# Altium schematic sheet HDMI.SchDoc: Dahlia Carrier Board
size A3; Organization: Toradex AG; Address1: Ebenaustrasse 10; Address2: Horw; Address3: 6048; Address4: Switzerland; DocumentNumber: 9; Revision: V1.1; SheetNumber: 9; SheetTotal: 21; PageSetup: Record=PageOptions|CenterHorizontal=True|CenterVertical=True|PrintScale=0.71|XCorrection=1.00|YCorrection=1.00|PrintKind=1|BorderSize=5000000|LeftOffset=0|BottomOffset=0|Orientation=2|PaperLength=1000|PaperWidth=1000|Scale=100|PaperSource=15|PrintQuality=600|MediaType=1|DitherType=10|PaperKind=A4|PrintScaleMode=1
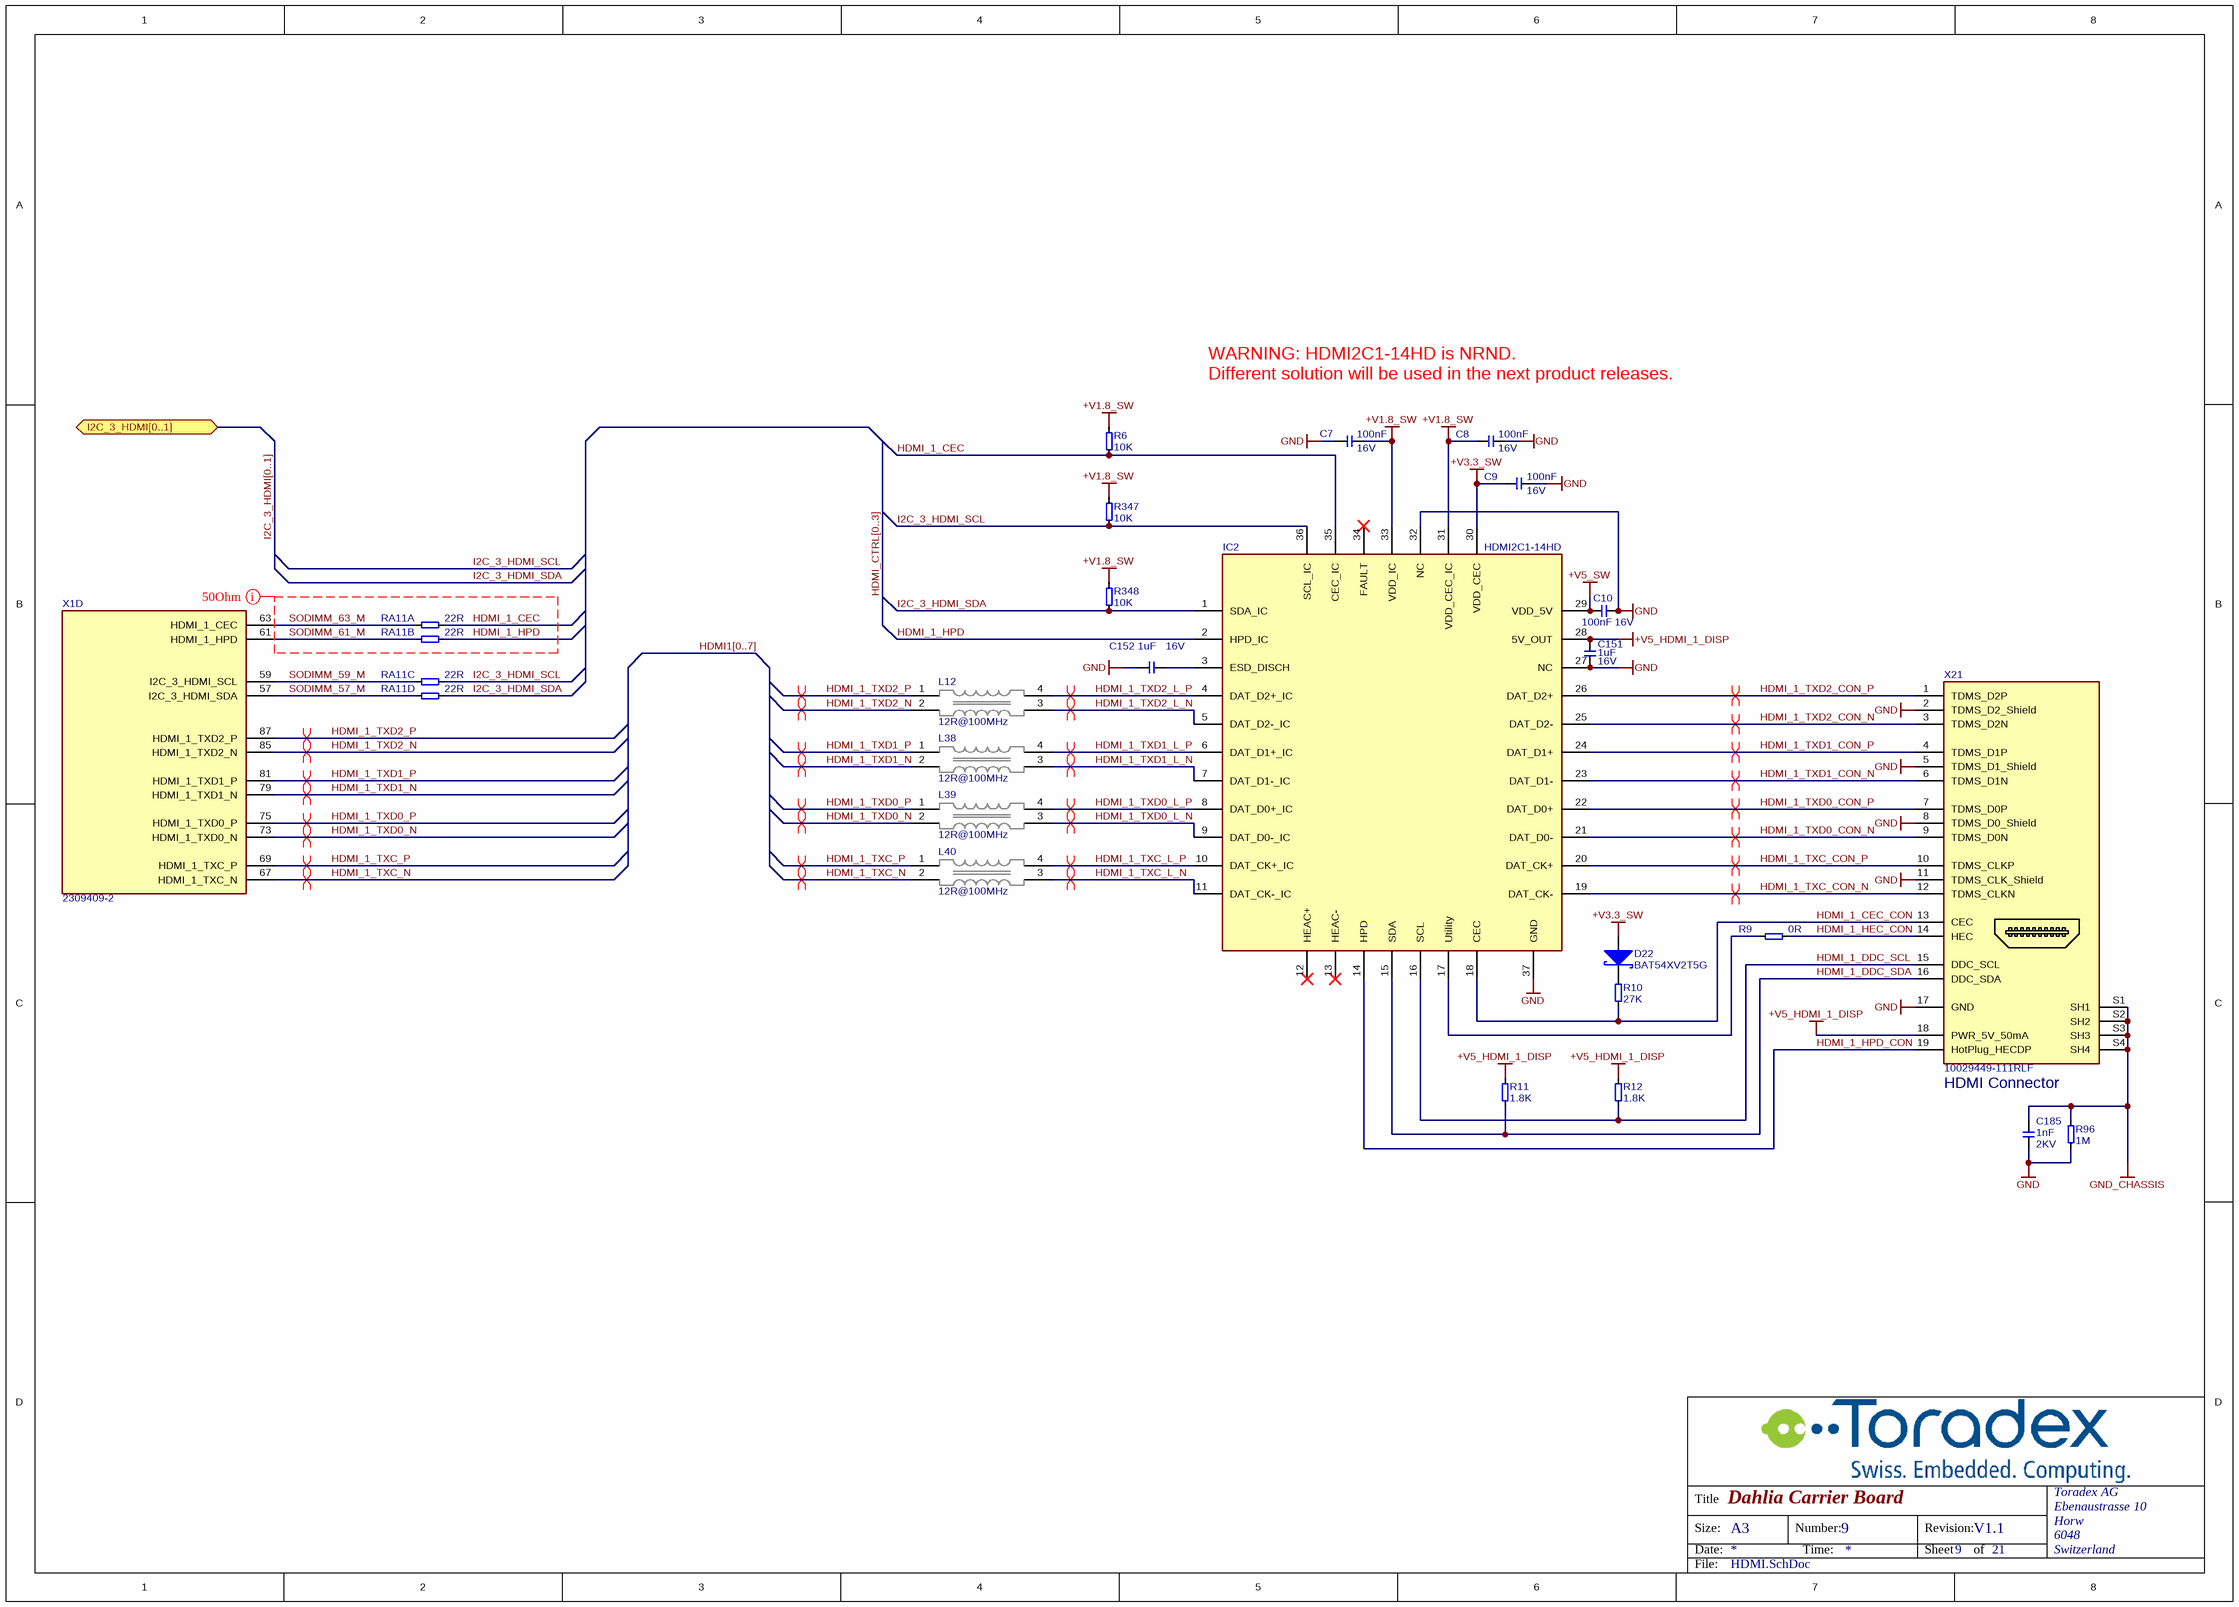
[diagram p0: HDMI.SchDoc]

## Parts
C7  Rating: 16V  [CAPC1005X60N]  (hidden comment: 100nF)
C8  Rating: 16V  [CAPC1005X60N]  (hidden comment: 100nF)
C9  Rating: 16V  [CAPC1005X60N]  (hidden comment: 100nF)
C10  Rating: 16V  [CAPC1005X60N]  (hidden comment: 100nF)
C151  Rating: 16V  [CAPC1005X60N]  (hidden comment: 1uF)
C152  Rating: 16V  [CAPC1005X60N]  (hidden comment: 1uF)
C185  Rating: 2KV  [T_CAPC1206X180N]  (hidden comment: 1nF)
D22  BAT54XV2T5G  [SOD-523]
IC2  HDMI2C1-14HD  [QFN50P350X650X95_HS-37N]
L12  12R@100MHz  [T_Panasonic_EXC14CH120U]
L38  12R@100MHz  [T_Panasonic_EXC14CH120U]
L39  12R@100MHz  [T_Panasonic_EXC14CH120U]
L40  12R@100MHz  [T_Panasonic_EXC14CH120U]
R6  10K  [RESC1005X40N]
R9  0R  [T_RESC0603X30N]
R10  27K  [RESC1005X40N]
R11  1.8K  [RESC1005X40N]
R12  1.8K  [RESC1005X40N]
R96  1M  [RESC3216X75N]
R347  10K  [RESC1005X40N]
R348  10K  [RESC1005X40N]
RA11  22R  [T_Resistor_Array_X4]  (parts A,B,C,D of 4)
X1  2309409-2  [CON-TE-2309409-2-SOLDERABLE-STANDOFFS]  (part D of 23)
X21  10029449-111RLF  [T_FCI_10029449-111RLF]

## Ports
I2C_3_HDMI[0..1] (bidir)

## Nets
+V1.8_SW: C7.2 C8.1 IC2.31(VDD_CEC_IC) IC2.33(VDD_IC) R6.2 R347.1 R348.1
+V3.3_SW: C9.2 D22.A IC2.30(VDD_CEC)
+V5_HDMI_1_DISP: C151.2 IC2.28(5V_OUT) R11.2 R12.2 X21.18(PWR_5V_50mA)
+V5_SW: C10.2 IC2.29(VDD_5V)
GND: C7.1 C8.2 C9.1 C10.1 C151.1 C152.2 C185.1 IC2.27(NC) IC2.32(NC) IC2.37(GND) R96.1 X21.2(TDMS_D2_Shield) X21.5(TDMS_D1_Shield) X21.8(TDMS_D0_Shield) X21.11(TDMS_CLK_Shield) X21.17(GND)
GND_CHASSIS: C185.2 R96.2 X21.S1(SH1) X21.S2(SH2) X21.S3(SH3) X21.S4(SH4)
HDMI_1_CEC: IC2.35(CEC_IC) R6.1 RA11.5
HDMI_1_CEC_CON: IC2.18(CEC) R10.1 X21.13(CEC)
HDMI_1_DDC_SCL: IC2.16(SCL) R12.1 X21.15(DDC_SCL)
HDMI_1_DDC_SDA: IC2.15(SDA) R11.1 X21.16(DDC_SDA)
HDMI_1_HEC_CON: R9.2 X21.14(HEC)
HDMI_1_HPD: IC2.2(HPD_IC) RA11.6
HDMI_1_HPD_CON: IC2.14(HPD) X21.19(HotPlug_HECDP)
HDMI_1_TXC_CON_N: IC2.19(DAT_CK-) X21.12(TDMS_CLKN)
HDMI_1_TXC_CON_P: IC2.20(DAT_CK+) X21.10(TDMS_CLKP)
HDMI_1_TXC_L_N: IC2.11(DAT_CK-_IC) L40.3
HDMI_1_TXC_L_P: IC2.10(DAT_CK+_IC) L40.4
HDMI_1_TXC_N: L40.2 X1.67(HDMI_1_TXC_N)
HDMI_1_TXC_P: L40.1 X1.69(HDMI_1_TXC_P)
HDMI_1_TXD0_CON_N: IC2.21(DAT_D0-) X21.9(TDMS_D0N)
HDMI_1_TXD0_CON_P: IC2.22(DAT_D0+) X21.7(TDMS_D0P)
HDMI_1_TXD0_L_N: IC2.9(DAT_D0-_IC) L39.3
HDMI_1_TXD0_L_P: IC2.8(DAT_D0+_IC) L39.4
HDMI_1_TXD0_N: L39.2 X1.73(HDMI_1_TXD0_N)
HDMI_1_TXD0_P: L39.1 X1.75(HDMI_1_TXD0_P)
HDMI_1_TXD1_CON_N: IC2.23(DAT_D1-) X21.6(TDMS_D1N)
HDMI_1_TXD1_CON_P: IC2.24(DAT_D1+) X21.4(TDMS_D1P)
HDMI_1_TXD1_L_N: IC2.7(DAT_D1-_IC) L38.3
HDMI_1_TXD1_L_P: IC2.6(DAT_D1+_IC) L38.4
HDMI_1_TXD1_N: L38.2 X1.79(HDMI_1_TXD1_N)
HDMI_1_TXD1_P: L38.1 X1.81(HDMI_1_TXD1_P)
HDMI_1_TXD2_CON_N: IC2.25(DAT_D2-) X21.3(TDMS_D2N)
HDMI_1_TXD2_CON_P: IC2.26(DAT_D2+) X21.1(TDMS_D2P)
HDMI_1_TXD2_L_N: IC2.5(DAT_D2-_IC) L12.3
HDMI_1_TXD2_L_P: IC2.4(DAT_D2+_IC) L12.4
HDMI_1_TXD2_N: L12.2 X1.85(HDMI_1_TXD2_N)
HDMI_1_TXD2_P: L12.1 X1.87(HDMI_1_TXD2_P)
I2C_3_HDMI_SCL: IC2.36(SCL_IC) R347.2 RA11.7
I2C_3_HDMI_SDA: IC2.1(SDA_IC) R348.2 RA11.8
SODIMM_57_M: RA11.4 X1.57(I2C_3_HDMI_SDA)
SODIMM_59_M: RA11.3 X1.59(I2C_3_HDMI_SCL)
SODIMM_61_M: RA11.2 X1.61(HDMI_1_HPD)
SODIMM_63_M: RA11.1 X1.63(HDMI_1_CEC)
NetC152_1: C152.1 IC2.3(ESD_DISCH)
NetD22_C: D22.C R10.2
NetIC2_17: IC2.17(Utility) R9.1

Not connected (* = marked no-connect by the designer): IC2 12(HEAC+)* 13(HEAC-)* 34(FAULT)*

## Buses and harness runs
bus HDMI1[0..7]
bus HDMI_CTRL[0..3]
bus I2C_3_HDMI[0..1] = port I2C_3_HDMI[0..1]

## Layout directives
differential pair; differential pair class HDMI: HDMI_1_TXC_CON_N, HDMI_1_TXC_CON_P, HDMI_1_TXC_L_N, HDMI_1_TXC_L_P, HDMI_1_TXC_N, HDMI_1_TXC_P, HDMI_1_TXD0_CON_N, HDMI_1_TXD0_CON_P, HDMI_1_TXD0_L_N, HDMI_1_TXD0_L_P, HDMI_1_TXD0_N, HDMI_1_TXD0_P, HDMI_1_TXD1_CON_N, HDMI_1_TXD1_CON_P, HDMI_1_TXD1_L_N, HDMI_1_TXD1_L_P, HDMI_1_TXD1_N, HDMI_1_TXD1_P, HDMI_1_TXD2_CON_N, HDMI_1_TXD2_CON_P, HDMI_1_TXD2_L_N, HDMI_1_TXD2_L_P, HDMI_1_TXD2_N, HDMI_1_TXD2_P
net class 50Ohm: HDMI_1_CEC, HDMI_1_HPD, SODIMM_61_M, SODIMM_63_M

## Notes on the sheet
- WARNING: HDMI2C1-14HD is NRND.
  Different solution will be used in the next product releases.
- HDMI Connector
- Title
- Size:
- Date:
- A3
- Number:
- Time:
- Revision:
- Sheet
- of
- File:

## Library data of the parts
C7-C10 = C-X7R-100nF-16V-10%-0402: Capacitor Ceramic X7R 100nF 16V 10% 0402; Tolerance: 10%; Type: X7R; Value: 100nF
C151 C152 = C-X5R-1uF-16V-20%-0402: Capacitor Ceramic X5R 1uF 16V 20% 0402; Tolerance: 20%; Type: X5R; Value: 1uF
C185 = C-X7R-1nF-2KV-10%-1206: Capacitor Ceramic X7R 1nF 2KV 10% 1206; Tolerance: 10%; Type: X7R; Value: 1nF
D22 = D-BAT54-SOD523: Schottky Barrier Rectifier; Manufacturer Name: On Semi; Manufacturer Part No.: BAT54XV2T5G
IC2 = IC-ST-HDMI2C1-14HD: ESD protection and signal conditioning for HDMI™ 2.0 source interface; Manufacturer Name: STMicroelectronics; Manufacturer Part No.: HDMI2C1-14HD
L12 L38-L40 = L-Panasonic-EXC14CH120U-12R@100MHz-1000mA-25%: Common Mode Choke High Speed 12R 100mA; Tolerance: 25%; Rating: 100mA; Manufacturer Name: Panasonic; Manufacturer Part No.: EXC14CH120U; Value: 12R@100MHz
R6 R347 R348 = R-10K-63mW-5%-0402: Resistor 10 Kohm 63mW 5% 0402; Rating: 63mW; Tolerance: 5%; Value: 10K
R9 = R-0R-63mW-1%-0603: Resistor 0 ohm 63mW 1% 0603; Rating: 63mW; Tolerance: 1%; Value: 0R
R10 = R-27K-63mW-5%-0402: Resistor 27 Kohm 63mW 5% 0402; Rating: 63mW; Tolerance: 5%; Value: 27K
R11 R12 = R-1.8K-63mW-5%-0402: Resistor 1.8 Kohm 63mW 5% 0402; Rating: 63mW; Tolerance: 5%; Value: 1.8K
R96 = R-1M-250mW-5%-1206: Resistor 1 Mohm 250mW 5% 1206; Rating: 250mW; Tolerance: 5%; Value: 1M
RA11 = RA-22R-63mW-5%-1206-div: Resistor Array 22 R 63mW 5% 1206; Tolerance: 5%; Power Dissipation: 63mW; Value: 22R
X1 = CON-TE-2309409-2: DDR4 SODIMM Socket, 260 pins, 5.2mm(H), 0.5mm Pitch; Manufacturer Name: TE; Temperature Range: -40C to +125C; Package: DDR4-SODIMM-260; Manufacturer Part No.: 2309409-2
X21 = CON-FCI-10029449-111RLF: HDMI Connector Right Angle Vertical THT; Manufacturer Name: FCI; No. of ways: 19; Manufacturer Part No.: 10029449-111RLF